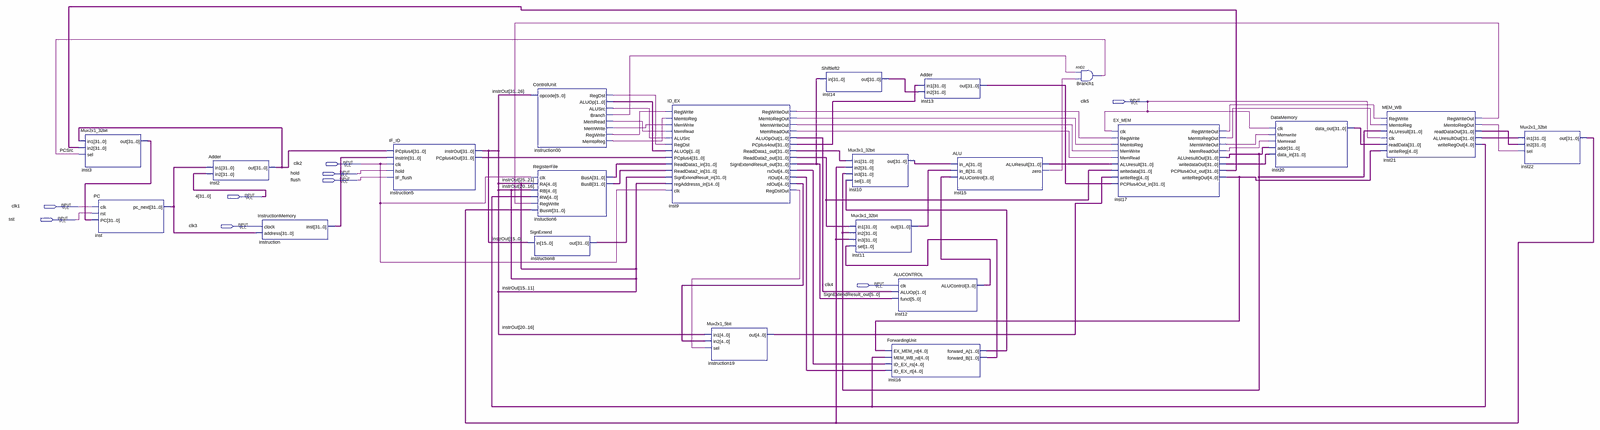
[diagram p0: schematic sheet, whole]
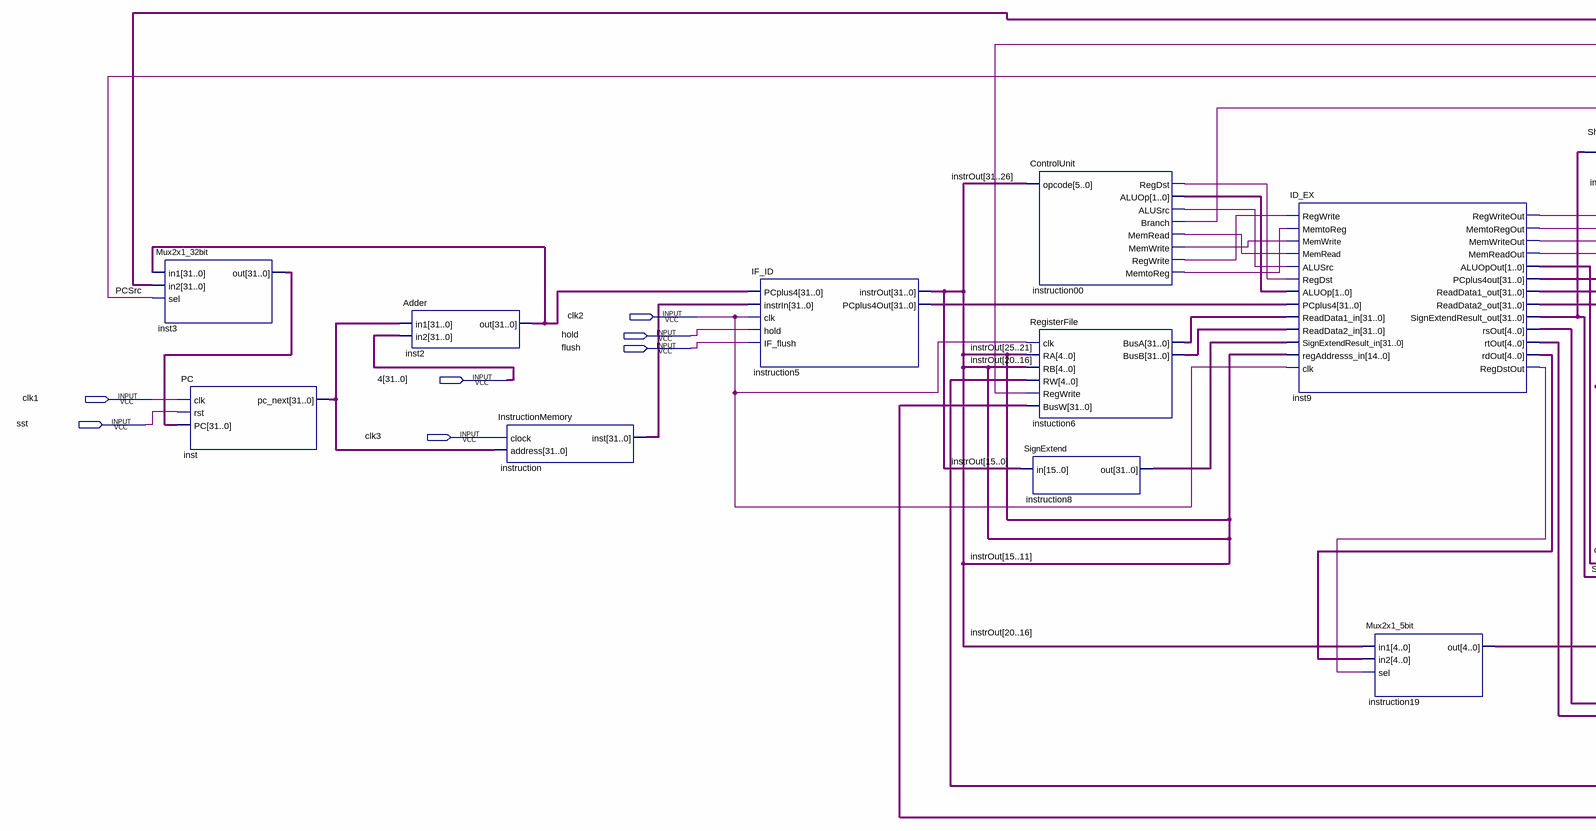
[diagram p1: schematic sheet, left part]
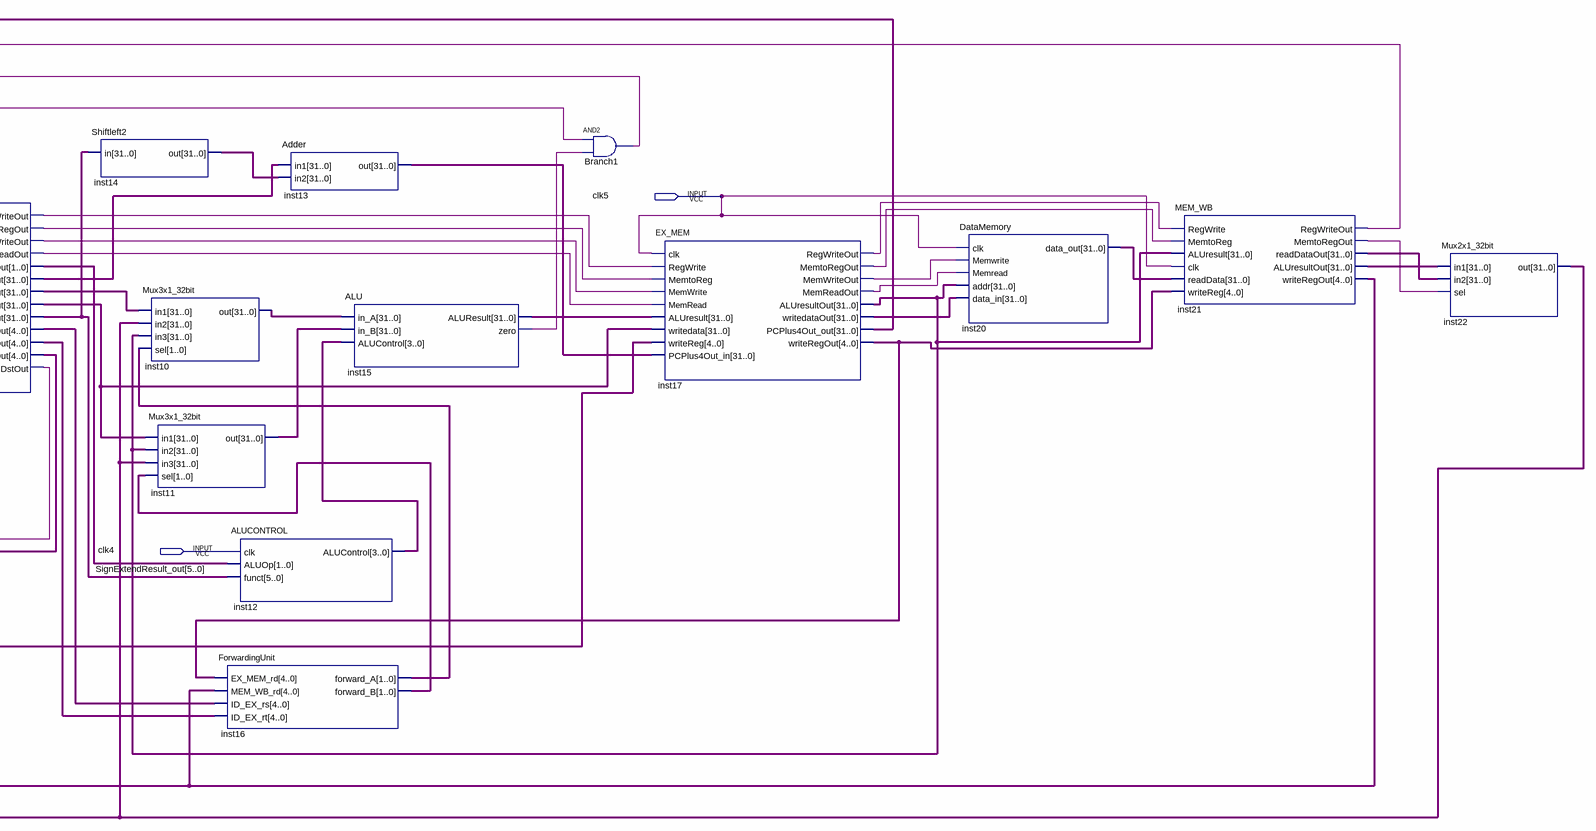
[diagram p2: schematic sheet, right part]
// Quartus schematic DataPath.bdf as structural Verilog: 22 symbols, 9 pins
module DataPath (
  input  clk5,
  input  clk2,
  input  hold,
  input  flush,
  input  [31:0] \4 ,
  input  clk1,
  input  sst,
  input  clk3,
  input  clk4
);

  wire inst9_memreadout, inst9_memtoregout, inst9_memwriteout, inst9_regdstout, inst9_regwriteout,
       inst15_zero, inst17_memreadout, inst17_memtoregout, inst17_memwriteout, inst17_regwriteout,
       inst21_memtoregout, inst21_regwriteout, instruction00_alusrc, instruction00_branch,
       instruction00_memread, instruction00_memtoreg, instruction00_memwrite, instruction00_regdst,
       instruction00_regwrite, PCSrc;
  wire [1:0] inst9_aluopout, inst16_forward_a, inst16_forward_b, instruction00_aluop;
  wire [3:0] inst12_alucontrol;
  wire [4:0] inst9_rdout, inst9_rsout, inst9_rtout, inst17_writeregout, inst21_writeregout, instruction19_out;
  wire [5:0] SignExtendResult_out;
  wire [31:0] inst2_out, inst3_out, inst9_pcplus4out, inst9_readdata1_out, inst9_readdata2_out, inst10_out,
       inst11_out, inst13_out, inst14_out, inst15_aluresult, inst17_aluresultout, inst17_pcplus4out_out,
       inst17_writedataout, inst20_data_out, inst21_aluresultout, inst21_readdataout, inst22_out,
       inst_pc_next, instrOut, instruction5_pcplus4out, instruction8_out, instruction_inst, instuction6_busa,
       instuction6_busb;

  Mux2x1_32bit inst3 (.in1(inst2_out), .in2(inst17_pcplus4out_out), .sel(PCSrc), .out(inst3_out));
  PC inst (.clk(clk1), .rst(sst), .PC(inst3_out), .pc_next(inst_pc_next));
  Adder inst2 (.in1(inst_pc_next), .in2(\4 ), .out(inst2_out));
  InstructionMemory instruction (.clock(clk3), .address(inst_pc_next), .inst(instruction_inst));
  IF_ID instruction5 (
    .PCplus4(inst2_out), .instrIn(instruction_inst), .clk(clk2), .hold(hold), .IF_flush(flush),
    .instrOut(instrOut), .PCplus4Out(instruction5_pcplus4out));
  ControlUnit instruction00 (
    .opcode(instrOut[31:26]), .RegDst(instruction00_regdst), .ALUOp(instruction00_aluop),
    .ALUSrc(instruction00_alusrc), .Branch(instruction00_branch), .MemRead(instruction00_memread),
    .MemWrite(instruction00_memwrite), .RegWrite(instruction00_regwrite), .MemtoReg(instruction00_memtoreg));
  RegisterFile instuction6 (
    .clk(clk2), .RA(instrOut[25:21]), .RB(instrOut), .RW(inst21_writeregout), .RegWrite(inst21_regwriteout),
    .BusW(inst22_out), .BusA(instuction6_busa), .BusB(instuction6_busb));
  SignExtend instruction8 (.in(instrOut[15:0]), .out(instruction8_out));
  ID_EX inst9 (
    .RegWrite(instruction00_regwrite), .MemtoReg(instruction00_memtoreg), .MemWrite(instruction00_memwrite),
    .MemRead(instruction00_memread), .ALUSrc(instruction00_alusrc), .RegDst(instruction00_regdst),
    .ALUOp(instruction00_aluop), .PCplus4(instruction5_pcplus4out), .ReadData1_in(instuction6_busa),
    .ReadData2_in(instuction6_busb), .SignExtendResult_in(instruction8_out), .regAddresss_in(instrOut),
    .clk(clk2), .RegWriteOut(inst9_regwriteout), .MemtoRegOut(inst9_memtoregout),
    .MemWriteOut(inst9_memwriteout), .MemReadOut(inst9_memreadout), .ALUOpOut(inst9_aluopout),
    .PCplus4out(inst9_pcplus4out), .ReadData1_out(inst9_readdata1_out), .ReadData2_out(inst9_readdata2_out),
    .SignExtendResult_out(SignExtendResult_out), .rsOut(inst9_rsout), .rtOut(inst9_rtout),
    .rdOut(inst9_rdout), .RegDstOut(inst9_regdstout));
  Mux2x1_5bit instruction19 (.in1(instrOut[20:16]), .in2(inst9_rdout), .sel(inst9_regdstout), .out(instruction19_out));
  Shiftleft2 inst14 (.in(SignExtendResult_out), .out(inst14_out));
  Mux3x1_32bit inst10 (
    .in1(inst9_readdata1_out), .in2(inst22_out), .in3(inst17_aluresultout), .sel(inst16_forward_a),
    .out(inst10_out));
  Mux3x1_32bit inst11 (
    .in1(inst9_readdata2_out), .in2(inst17_aluresultout), .in3(inst22_out), .sel(inst16_forward_b),
    .out(inst11_out));
  ForwardingUnit inst16 (
    .EX_MEM_rd(inst17_writeregout), .MEM_WB_rd(inst21_writeregout), .ID_EX_rs(inst9_rsout),
    .ID_EX_rt(inst9_rtout), .forward_A(inst16_forward_a), .forward_B(inst16_forward_b));
  ALUCONTROL inst12 (.clk(clk4), .ALUOp(inst9_aluopout), .funct(SignExtendResult_out), .ALUControl(inst12_alucontrol));
  Adder inst13 (.in1(inst9_pcplus4out), .in2(inst14_out), .out(inst13_out));
  ALU inst15 (
    .in_A(inst10_out), .in_B(inst11_out), .ALUControl(inst12_alucontrol), .ALUResult(inst15_aluresult),
    .zero(inst15_zero));
  and Branch1 (PCSrc, instruction00_branch, inst15_zero);
  EX_MEM inst17 (
    .clk(clk5), .RegWrite(inst9_regwriteout), .MemtoReg(inst9_memtoregout), .MemWrite(inst9_memwriteout),
    .MemRead(inst9_memreadout), .ALUresult(inst15_aluresult), .writedata(inst9_readdata2_out),
    .writeReg(instruction19_out), .PCPlus4Out_in(inst13_out), .RegWriteOut(inst17_regwriteout),
    .MemtoRegOut(inst17_memtoregout), .MemWriteOut(inst17_memwriteout), .MemReadOut(inst17_memreadout),
    .ALUresultOut(inst17_aluresultout), .writedataOut(inst17_writedataout),
    .PCPlus4Out_out(inst17_pcplus4out_out), .writeRegOut(inst17_writeregout));
  DataMemory inst20 (
    .clk(clk5), .Memwrite(inst17_memwriteout), .Memread(inst17_memreadout), .addr(inst17_aluresultout),
    .data_in(inst17_writedataout), .data_out(inst20_data_out));
  MEM_WB inst21 (
    .RegWrite(inst17_regwriteout), .MemtoReg(inst17_memtoregout), .ALUresult(inst17_aluresultout),
    .clk(clk5), .readData(inst20_data_out), .writeReg(inst17_writeregout), .RegWriteOut(inst21_regwriteout),
    .MemtoRegOut(inst21_memtoregout), .readDataOut(inst21_readdataout), .ALUresultOut(inst21_aluresultout),
    .writeRegOut(inst21_writeregout));
  Mux2x1_32bit inst22 (.in1(inst21_aluresultout), .in2(inst21_readdataout), .sel(inst21_memtoregout), .out(inst22_out));
endmodule
